# EAGLE design HomeAutomation_ESP (EAGLE 8.2.2)
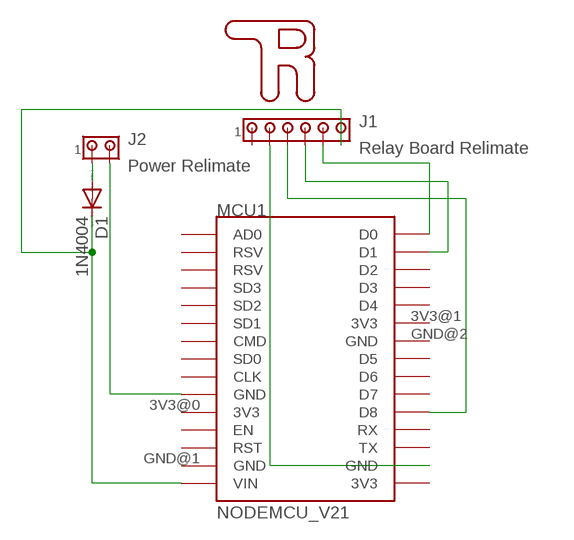
[diagram p0: schematic, sheet 1]

## Parts
D1  1N4004  [DO41-10]
J1  Relay Board Relimate  MTA06-100  [10X06MTA]
J2  Power Relimate  MTA02-100  [10X02MTA]
MCU1  NODEMCU_V21  [NODEMCU_NOSILK]
U$1  TRLOGO2  [TRLOGO_6.4]

## Nets
5V: D1.C J1.6 MCU1.VIN
5V@0: D1.A J2.1
GND@0: J2.2 MCU1.GND@0(GND)
GND@1: J1.2 MCU1.GND@3(GND)
R1: J1.5 MCU1.D0
R2: J1.4 MCU1.D1
R3: J1.3 MCU1.D8
Unconnected: J1.1 MCU1.3V3@0(3V3) MCU1.3V3@1(3V3) MCU1.3V3@2(3V3) MCU1.AD0 MCU1.CLK MCU1.CMD MCU1.D2 MCU1.D3 MCU1.D4 MCU1.D5 MCU1.D6 MCU1.D7 MCU1.EN MCU1.GND@1(GND) MCU1.GND@2(GND) MCU1.RST MCU1.RSV@0(RSV) MCU1.RSV@1(RSV) MCU1.RX MCU1.SD0 MCU1.SD1 MCU1.SD2 MCU1.SD3 MCU1.TX

## Library data of the parts
D1 = diode:1N4004: DIODE general purpose rectifier, 1 A
J1 = con-amp:MTA06-100: AMP connector Connection corrected 2014-09-19
J2 = con-amp:MTA02-100: AMP connector
MCU1 = NODEMCU:NODEMCU_V2
U$1 = TRLOGO:TRLOGO

## Board
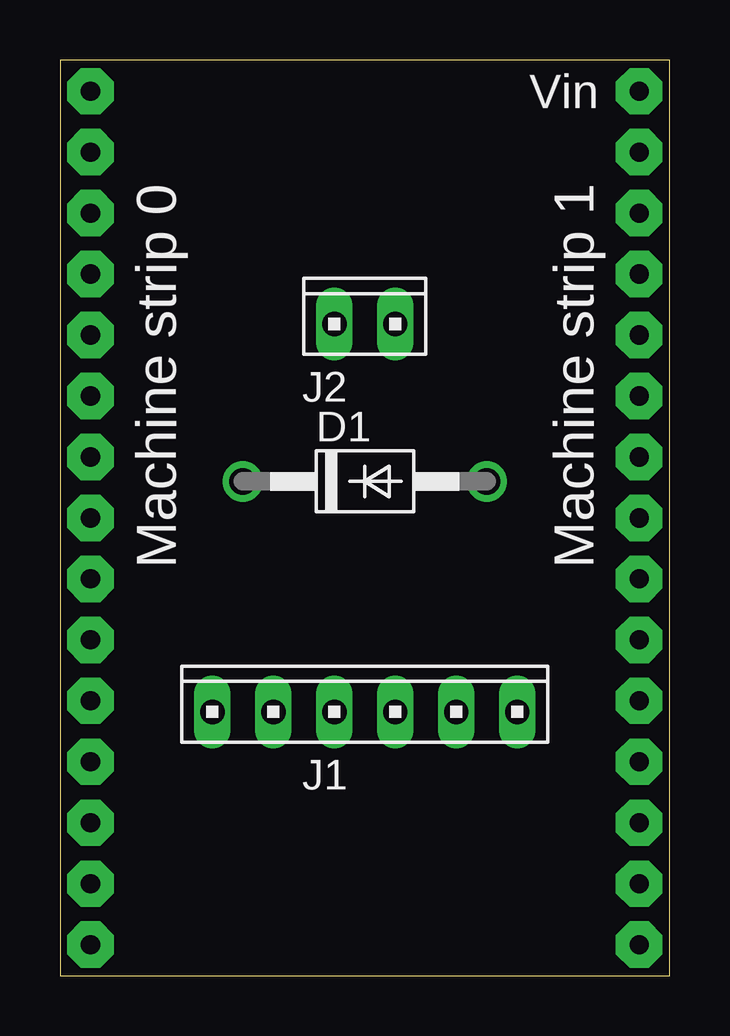
[diagram p1: board, top side]
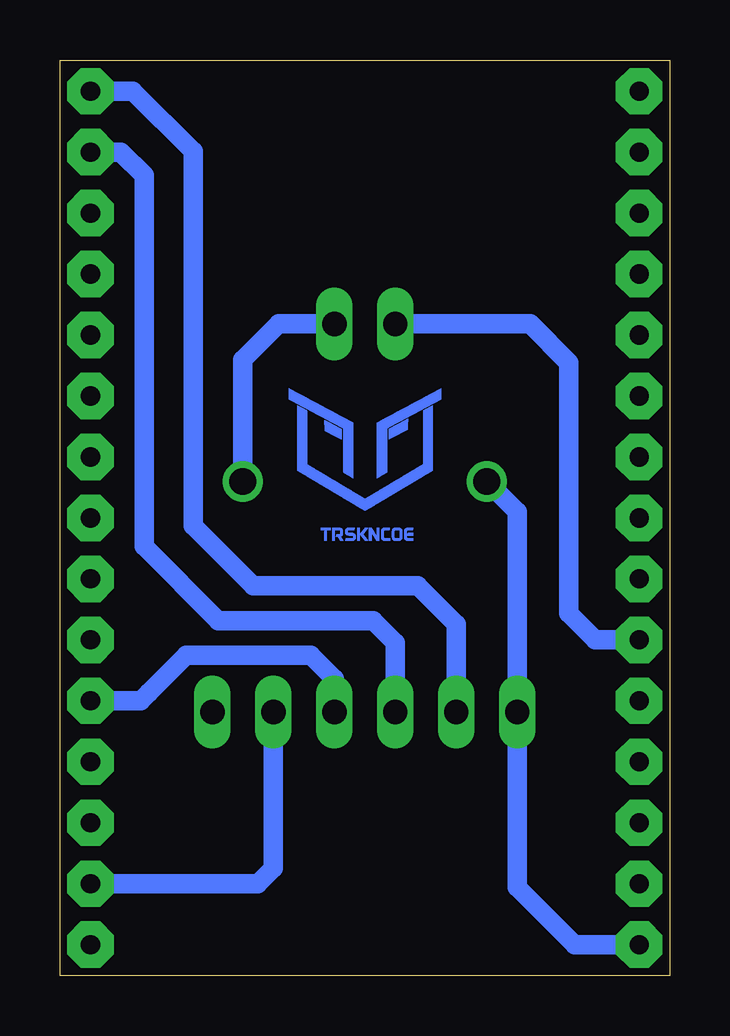
[diagram p2: board, bottom side, seen from below]

Size 25.4 x 38.16 mm. Coordinates in mm from the lower left corner, seen from the top.
Outline: 0,0 25.4,0 25.4,38.16 0,38.16 0,0
Copper layers (1*16): Top 0.035mm / dielectric 1.5mm / Bottom 0.035mm
Design rules "default": minimum track width 6mil, minimum drill 0.35mm, track to track 6mil, track to pad 6mil, pad to pad 6mil, via to via 6mil, smd to smd 6mil, copper to edge 40mil, drill to drill 6mil, minimum pad ring 10mil, minimum via ring 8mil, stop-mask expansion 4mil, vias tented up to drill 0mil, thermal gap 10mil

### Footprints (pad centres in the part's own frame; a part is rotated, then mirrored left to right if it is on the bottom)
DO41-10 = drill 1.118: A 5.08,0; C -5.08,0
10X06MTA = drill 1.016 long: 1 6.35,0; 2 3.81,0; 3 1.27,0; 4 -1.27,0; 5 -3.81,0; 6 -6.35,0
10X02MTA = drill 1.016 long: 1 1.27,0; 2 -1.27,0
NODEMCU_NOSILK = drill 0.8 pad 1.93 octagon: 3V3@0 -11.43,-7.62; 3V3@1 11.43,5.08; 3V3@2 11.43,-17.78; AD0 -11.43,17.78; CLK -11.43,-2.54; CMD -11.43,2.54; D0 11.43,17.78; D1 11.43,15.24; D2 11.43,12.7; D3 11.43,10.16; D4 11.43,7.62; D5 11.43,0; D6 11.43,-2.54; D7 11.43,-5.08; D8 11.43,-7.62; EN -11.43,-10.16; GND@0 -11.43,-5.08; GND@1 -11.43,-15.24; GND@2 11.43,2.54; GND@3 11.43,-15.24; RST -11.43,-12.7; RSV@0 -11.43,15.24; RSV@1 -11.43,12.7; RX 11.43,-10.16; SD0 -11.43,0; SD1 -11.43,5.08; SD2 -11.43,7.62; SD3 -11.43,10.16; TX 11.43,-12.7; VIN -11.43,-17.78

### Placement (x,y rotation side)
D1  12.7,20.6 0 top
J1  12.7,11 0 top
J2  12.7,27.16 0 top
MCU1  12.7,19.08 0 top
U$1  12.7,21.3 0 top

### Tracks (layer width: path | path; a pad name or v marks a point on that pad's centre or on a via)
5V
  Bottom 0.813: MCU1.VIN 3.95,1.3 6.35,3.7 J1.6 6.35,19.33 D1.C
5V@0
  Bottom 0.813: J2.1 16.29,27.16 17.78,25.67 D1.A
GND@0
  Bottom 0.813: MCU1.GND@0 3.1,14 4.2,15.1 4.2,25.55 5.81,27.16 J2.2
GND@1
  Bottom 0.813: MCU1.GND@3 17.16,3.84 16.51,4.49 J1.2
R1
  Bottom 0.813: MCU1.D0 22.36,36.86 19.85,34.35 19.85,18.75 17.35,16.25 10.5,16.25 8.89,14.64 J1.5
R2
  Bottom 0.813: MCU1.D1 22.87,34.32 21.9,33.35 21.9,17.9 18.8,14.8 12.35,14.8 11.43,13.88 J1.4
R3
  Bottom 0.813: J1.3 13.97,12.37 14.95,13.35 20.15,13.35 21.7,11.8 | 21.7,11.8 | MCU1.D8 22.04,11.46 21.7,11.8

### Text on the board
tPlace: Vin | Machine strip 0 | Machine strip 1